# EAGLE design P00R80 (EAGLE 9.3.0)
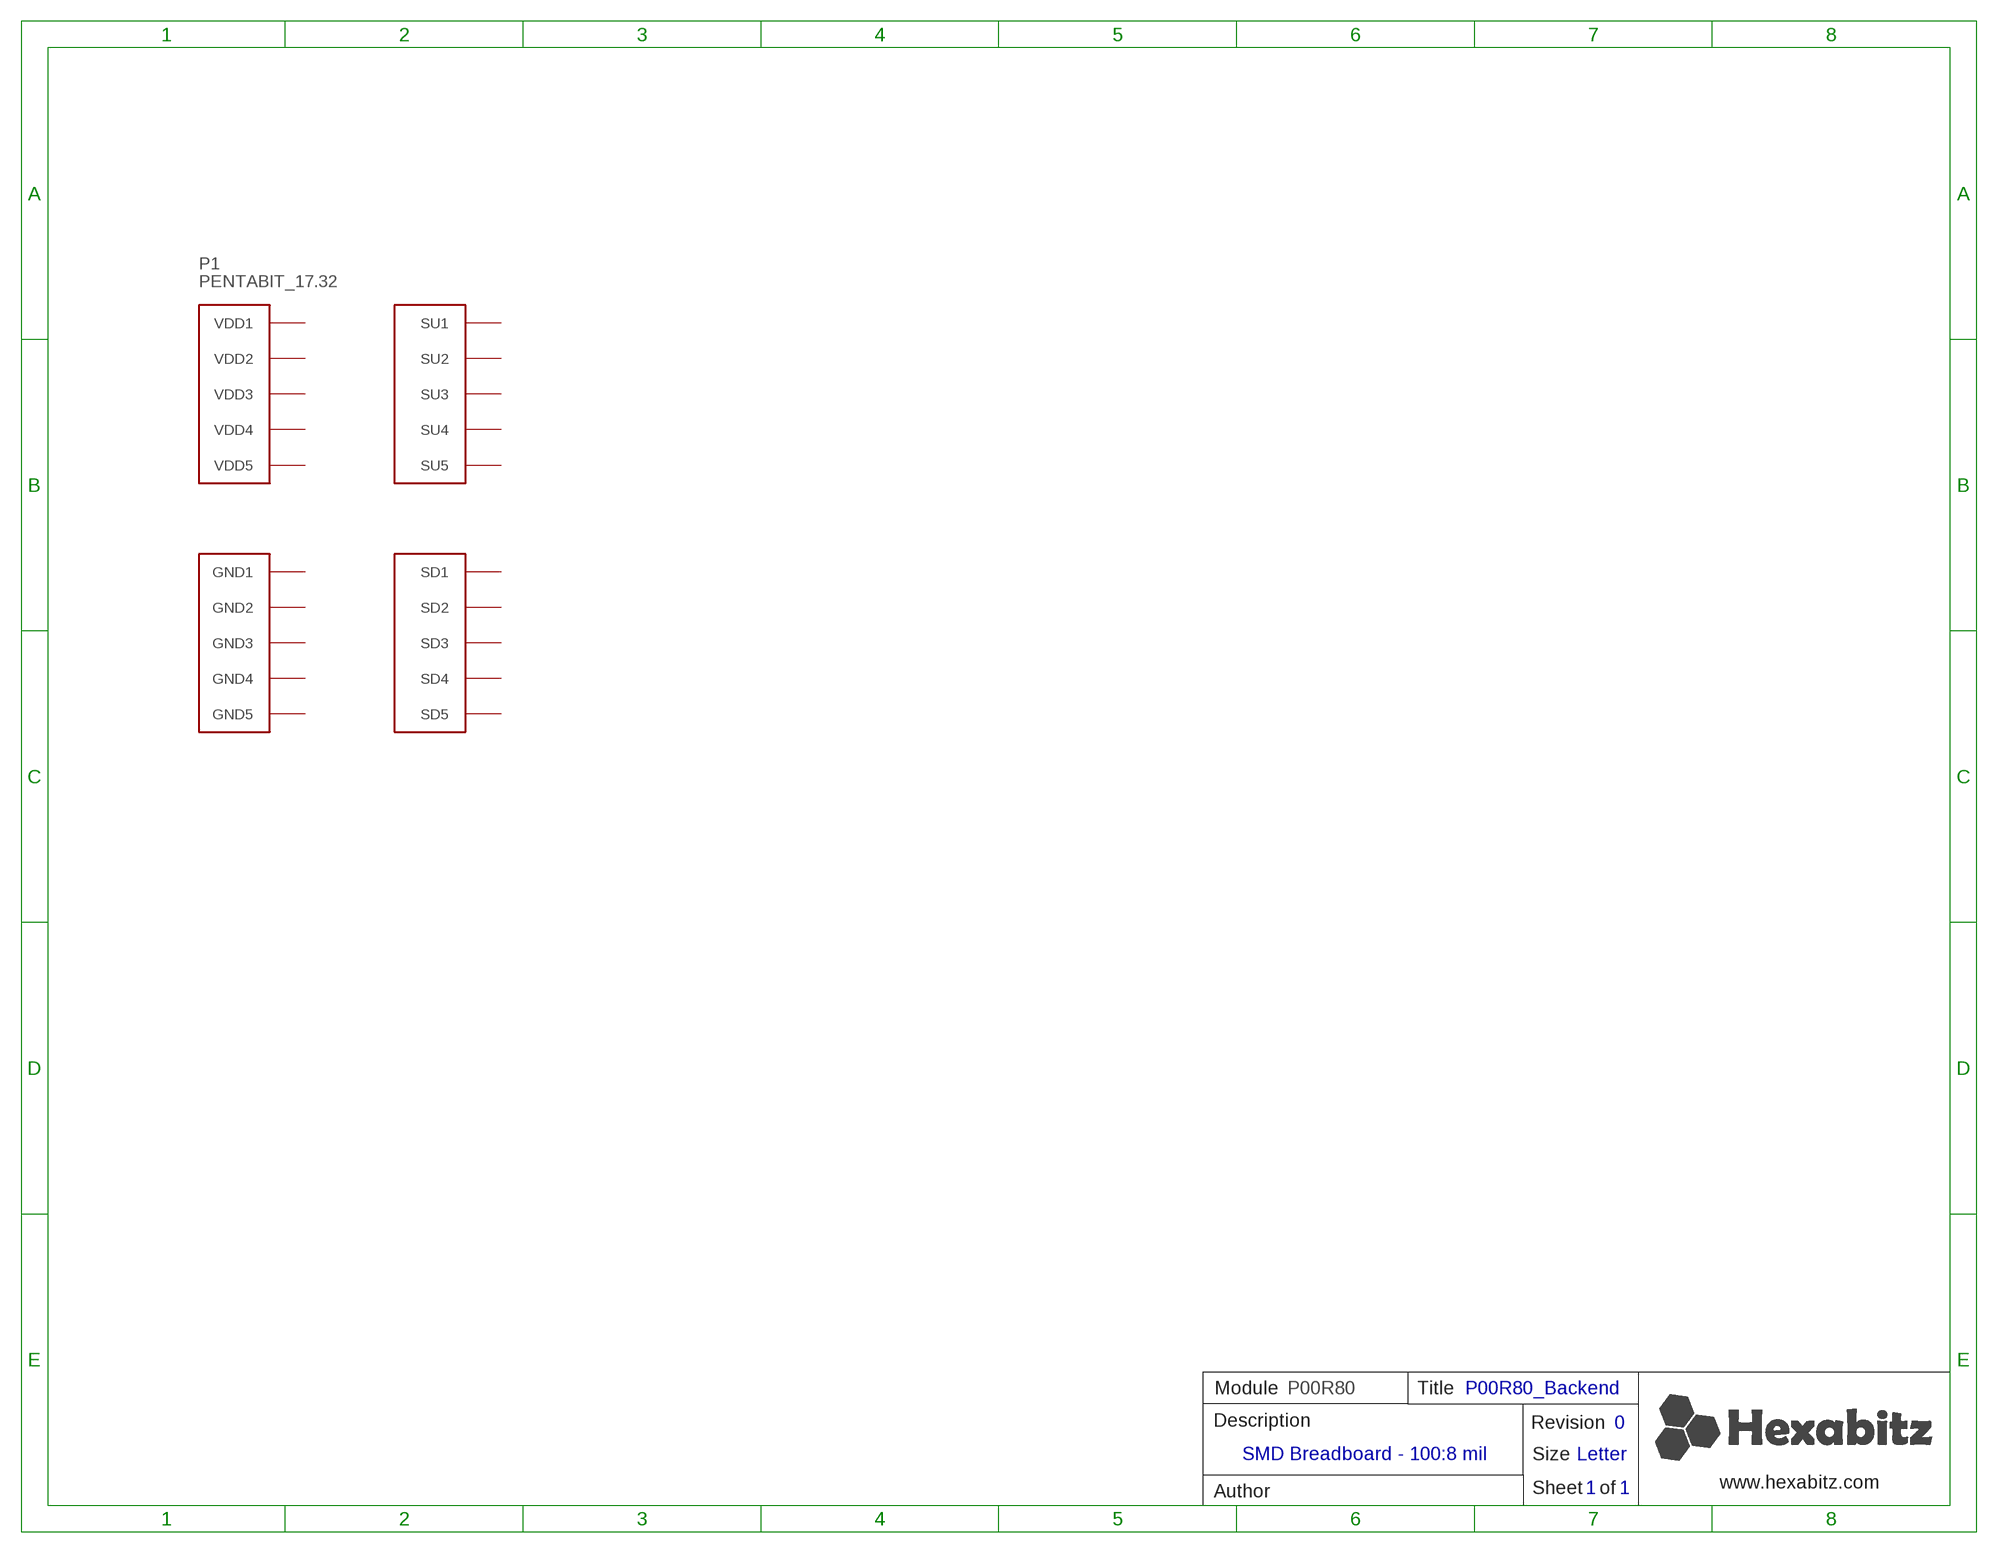
[diagram p0: schematic, sheet 1]

## Parts
P1  PENTABIT_17.32  [PENTABIT_17.32]
Unconnected: P1.PAD_PD1(SD1) P1.PAD_PD2(SD2) P1.PAD_PD3(SD3) P1.PAD_PD4(SD4) P1.PAD_PD5(SD5) P1.PAD_PU1(SU1) P1.PAD_PU2(SU2) P1.PAD_PU3(SU3) P1.PAD_PU4(SU4) P1.PAD_PU5(SU5)

## Notes on the sheet
- Module | P00R80 | Title | P00R80_Backend
- Description | Revision | 0
- SMD Breadboard - 100:8 mil
- Size | Letter
- www.hexabitz.com
- Author | Sheet   of | 1 | 1
- C:/Users/Admin/Desktop/logodraft.bmp

## Power pins joined to a net without a drawn wire
GND1: P1.PAD_PD6(GND1)
GND2: P1.PAD_PD7(GND2)
GND3: P1.PAD_PD8(GND3)
GND4: P1.PAD_PD9(GND4)
GND5: P1.PAD_PD10(GND5)
VDD1: P1.PAD_PU6(VDD1)
VDD2: P1.PAD_PU7(VDD2)
VDD3: P1.PAD_PU8(VDD3)
VDD4: P1.PAD_PU9(VDD4)
VDD5: P1.PAD_PU10(VDD5)

## Library data of the parts
P1 = hexabitz_connectors:PENTABIT_?: Hexabitz Pentagon Module Connector Pentagon side length = 17.32mm.

## Board
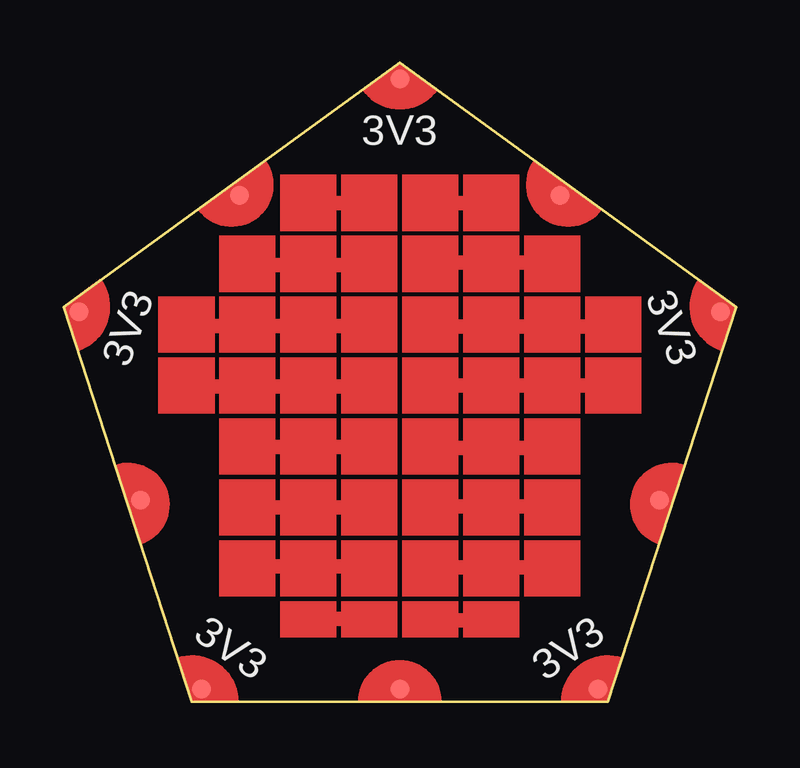
[diagram p1: board, top side]
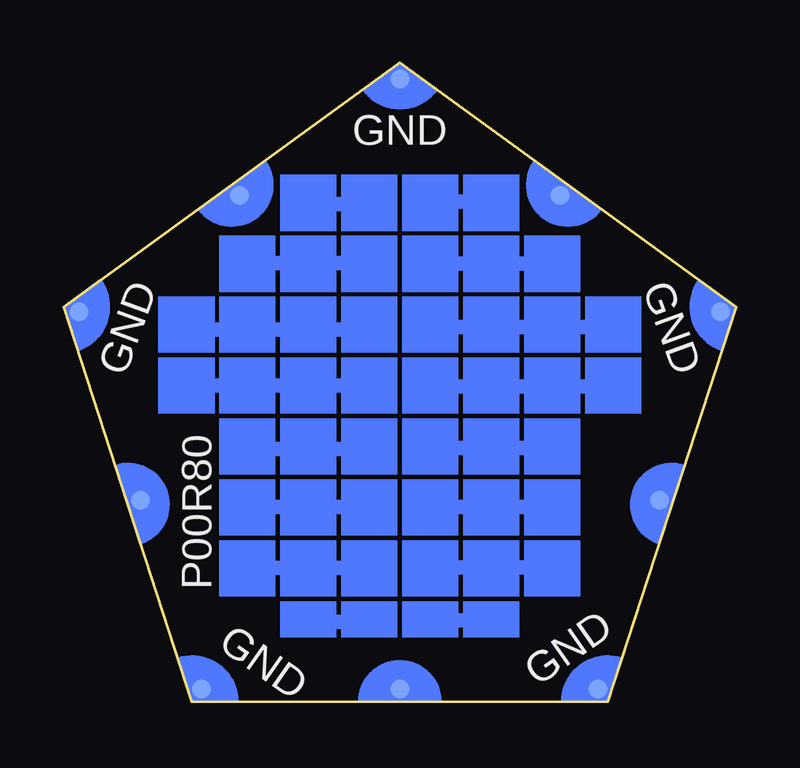
[diagram p2: board, bottom side, seen from below]

Size 28.02 x 26.65 mm. Coordinates in mm from the lower left corner, seen from the top.
Copper layers (1*16): Top 0.035mm / dielectric 1.5mm / Bottom 0.035mm
Design rules "2_layer": minimum track width 7mil, minimum drill 10mil, track to track 6mil, track to pad 6mil, pad to pad 6mil, via to via 6mil, smd to smd 0mil, copper to edge 1mil, drill to drill 8mil, minimum pad ring 10mil, minimum via ring 8mil, stop-mask expansion 2mil, vias tented up to drill 15mil, thermal gap 10mil

### Footprints (pad centres in the part's own frame; a part is rotated, then mirrored left to right if it is on the bottom)
PENTABIT_17.32 = smd 0.8 x 0.8 bottom: PAD_PD1 6.68,9.2; PAD_PD2 10.81,-3.51; PAD_PD3 0,-11.37; PAD_PD4 -10.81,-3.51; PAD_PD5 -6.68,9.2; PAD_PD6 0,14.05; PAD_PD7 13.36,4.34; PAD_PD8 8.26,-11.37; PAD_PD9 -8.26,-11.37; PAD_PD10 -13.36,4.34 | smd 0.8 x 0.8: PAD_PU1 6.68,9.2; PAD_PU2 10.81,-3.51; PAD_PU3 0,-11.37; PAD_PU4 -10.81,-3.51; PAD_PU5 -6.68,9.2; PAD_PU6 0,14.05; PAD_PU7 13.36,4.34; PAD_PU8 8.26,-11.37; PAD_PU9 -8.26,-11.37; PAD_PU10 -13.36,4.34

### Placement (x,y rotation side)
P1  14.01,11.92 0 top

### Tracks (layer width: path | path; a pad name or v marks a point on that pad's centre or on a via)
N$1
  Top 0.61: 10.23,20.81 12.56,20.81 12.66,20.71
N$2
  Top 0.61: 15.15,20.81 17.72,20.81
N$3
  Top 0.61: 7.48,18.22 12.74,18.22
N$4
  Top 0.61: 15.25,18.32 20.26,18.32 20.31,18.37
N$5
  Top 0.61: 5.09,15.68 12.84,15.68
N$6
  Top 0.61: 15.23,15.65 22.82,15.65 22.87,15.6
N$7
  Top 0.61: 5.02,13.16 12.77,13.16 12.82,13.11
N$8
  Top 0.61: 15.31,13.19 22.87,13.19 22.9,13.22
N$9
  Top 0.61: 7.69,10.62 12.54,10.62 12.59,10.68
N$10
  Top 0.61: 15.28,10.6 20.33,10.6
N$11
  Top 0.61: 7.69,8.11 12.79,8.11 12.87,8.03
N$12
  Top 0.61: 7.58,5.65 12.74,5.65
N$13
  Top 0.61: 15.13,8.16 20.31,8.16 20.33,8.19
N$14
  Top 0.61: 15.28,5.62 20.41,5.62 20.44,5.6
N$15
  Top 0.61: 15.2,3.41 17.64,3.41 17.69,3.36
N$16
  Top 0.61: 10.05,3.46 12.82,3.46 12.84,3.44
N$17
  Bottom 0.61: 10.17,20.86 12.54,20.86 12.77,20.63
N$18
  Bottom 0.61: 15.2,20.76 17.79,20.76 17.85,20.71
N$19
  Bottom 0.61: 15.1,18.3 20.33,18.3 20.39,18.24
N$20
  Bottom 0.61: 22.9,15.53 15.13,15.53 15.05,15.6
N$21
  Bottom 0.61: 15.25,13.14 15.31,13.19 22.9,13.19
N$22
  Bottom 0.61: 20.54,10.55 15.2,10.55
N$23
  Bottom 0.61: 12.82,18.27 7.53,18.27 7.46,18.19
N$24
  Bottom 0.61: 12.92,15.63 5.12,15.63 5.09,15.65
N$25
  Bottom 0.61: 4.94,13.16 12.77,13.16 12.89,13.04
N$26
  Bottom 0.61: 12.56,10.6 7.66,10.6
N$27
  Bottom 0.61: 7.61,8.14 12.66,8.14 12.69,8.11
N$28
  Bottom 0.61: 15.23,8.14 20.23,8.14
N$29
  Bottom 0.61: 15.25,5.6 20.31,5.6 20.33,5.62
N$30
  Bottom 0.61: 17.59,3.33 15.18,3.33 15.15,3.36
N$31
  Bottom 0.61: 12.84,3.41 10.15,3.41 10.1,3.46
N$32
  Bottom 0.61: 7.46,5.62 12.74,5.62 12.77,5.65
(copper drawn outside any net)
  shapes: Bottom area x48, Top area x48

### Text on the board
tPlace: 3V3 | 3V3 | 3V3 | 3V3 | 3V3
bPlace: GND | GND | GND | P00R80 | GND | GND